# Altium schematic sheet DISPLAY.SchDoc
size A4; SheetNumber: 6; SheetTotal: 6
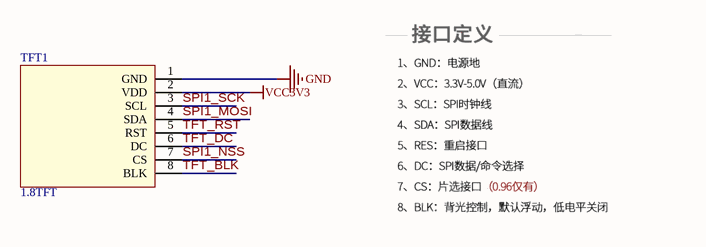
[diagram p0: DISPLAY.SchDoc]

## Parts
TFT1  1.8TFT  [1.8TFT]

## Nets
GND: TFT1.1(GND)
VCC3V3: TFT1.2(VDD)
SPI1_MOSI: TFT1.4(SDA)
SPI1_NSS: TFT1.7(CS)
SPI1_SCK: TFT1.3(SCL)
TFT_BLK: TFT1.8(BLK)
TFT_DC: TFT1.6(DC)
TFT_RST: TFT1.5(RST)